# EAGLE design messverstaerker-adc-proto (EAGLE 9.6.0)
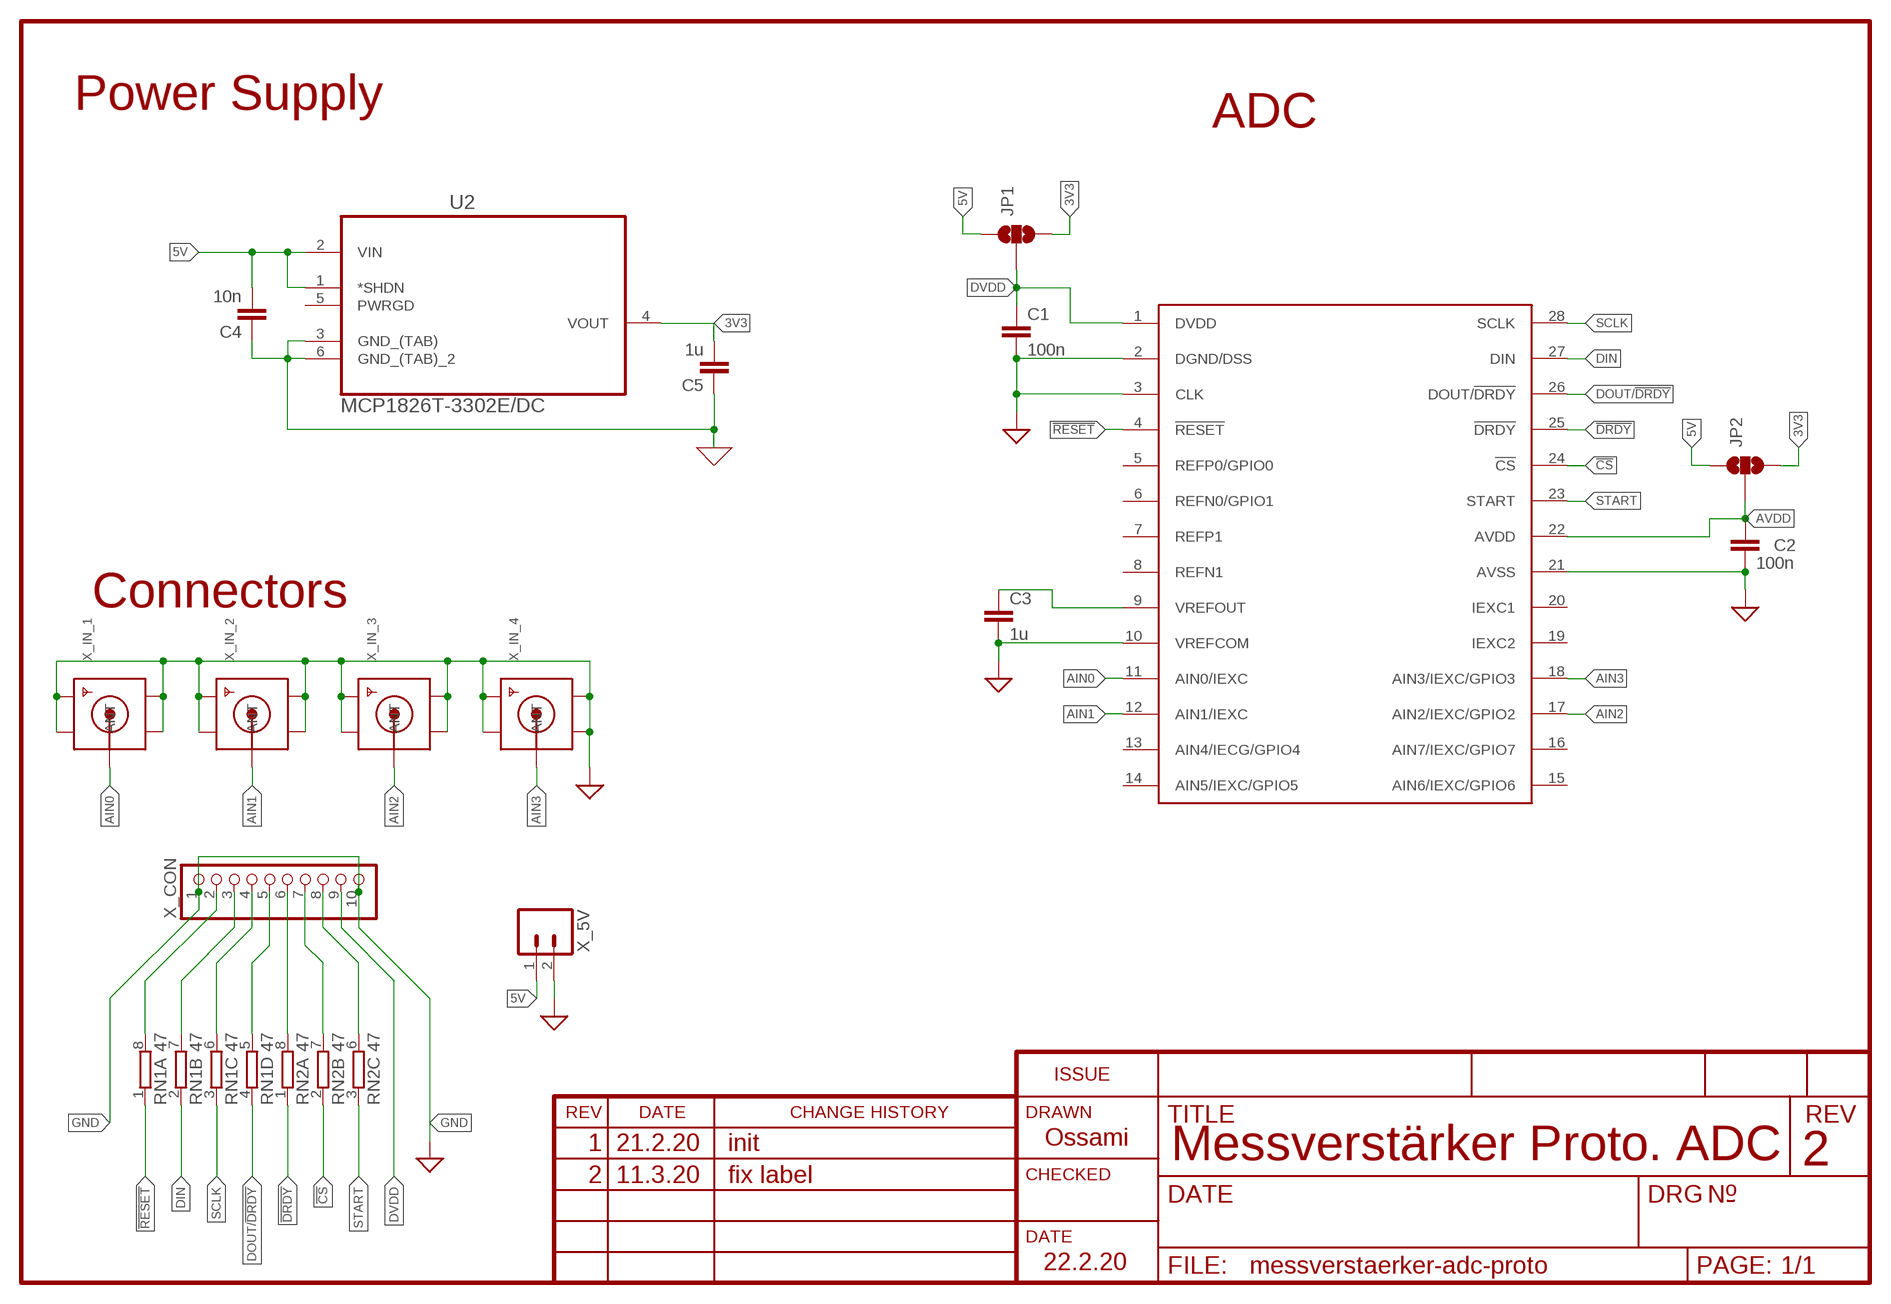
[diagram p0: schematic, sheet 1]

## Parts
C1  100n  C-EUC0805  [C0805]
C2  100n  C-EUC0805  [C0805]
C3  1u  C-EUC0805  [C0805]
C4  10n  C-EUC0805  [C0805]
C5  1u  C-EUC0805  [C0805]
JP1  JUMPER-SMT_3_NO_NO-SILK  [SMT-JUMPER_3_NO_NO-SILK]
JP2  JUMPER-SMT_3_NO_NO-SILK  [SMT-JUMPER_3_NO_NO-SILK]
RN1  47  4R-NEXBS8V  [EXBS8V]
RN2  47  4R-NEXBS8V  [EXBS8V]
U1  ADS1148QPWRQ1  [TSSOP28]
U2  MCP1826T-3302E/DC  MCP1826T-3002E/DC  [SOT230P700X180-6N]
X_5V  M02LOCK  [1X02_LOCK]
X_CON  PINHD-1X10  [1X10-BIG]
X_IN_1  SMACONNECTOR_EDGE  [SMA_EDGELAUNCH]
X_IN_2  SMACONNECTOR_EDGE  [SMA_EDGELAUNCH]
X_IN_3  SMACONNECTOR_EDGE  [SMA_EDGELAUNCH]
X_IN_4  SMACONNECTOR_EDGE  [SMA_EDGELAUNCH]

## Nets
0: C4.1 C5.1 U2.3(GND_(TAB)) U2.6(GND_(TAB)_2) ; supply symbol labelled GND
3V3: C5.2 JP1.3 JP2.3 U2.4(VOUT)
5V: C4.2 JP1.1 JP2.1 U2.1(*SHDN) U2.2(VIN) X_5V.1
!CS: RN2.2 U1.24(!CS)
!DRDY: RN2.1 U1.25(!DRDY)
!RESET: RN1.1 U1.4(!RESET)
AIN0: U1.11(AIN0/IEXC) X_IN_1.P(ANT)
AIN1: U1.12(AIN1/IEXC) X_IN_2.P(ANT)
AIN2: U1.17(AIN2/IEXC/GPIO2) X_IN_3.P(ANT)
AIN3: U1.18(AIN3/IEXC/GPIO3) X_IN_4.P(ANT)
AVDD: C2.1 JP2.2 U1.22(AVDD)
DIN: RN1.2 U1.27(DIN)
DOUT/!DRDY: RN1.4 U1.26(DOUT/!DRDY)
DVDD: C1.1 JP1.2 U1.1(DVDD) X_CON.9
GND: C1.2 C2.2 C3.2 U1.2(DGND/DSS) U1.3(CLK) U1.10(VREFCOM) U1.21(AVSS) X_5V.2 X_CON.1 X_CON.10 X_IN_1.GND@1(GND4) X_IN_1.GND@2(GND3) X_IN_1.GND@3(GND2) X_IN_1.GND@4(GND1) X_IN_2.GND@1(GND4) X_IN_2.GND@2(GND3) X_IN_2.GND@3(GND2) X_IN_2.GND@4(GND1) X_IN_3.GND@1(GND4) X_IN_3.GND@2(GND3) X_IN_3.GND@3(GND2) X_IN_3.GND@4(GND1) X_IN_4.GND@1(GND4) X_IN_4.GND@2(GND3) X_IN_4.GND@3(GND2) X_IN_4.GND@4(GND1) ; supply symbol labelled SUP
N$1: RN1.5 X_CON.5
N$2: C3.1 U1.9(VREFOUT)
N$3: RN2.8 X_CON.6
N$5: RN2.7 X_CON.7
N$6: RN2.6 X_CON.8
N$17: RN1.6 X_CON.4
N$18: RN1.7 X_CON.3
N$19: RN1.8 X_CON.2
SCLK: RN1.3 U1.28(SCLK)
START: RN2.3 U1.23(START)
Unconnected: RN2.4 RN2.5 U1.5(REFP0/GPIO0) U1.6(REFN0/GPIO1) U1.7(REFP1) U1.8(REFN1) U1.13(AIN4/IECG/GPIO4) U1.14(AIN5/IEXC/GPIO5) U1.15(AIN6/IEXC/GPIO6) U1.16(AIN7/IEXC/GPIO7) U1.19(IEXC2) U1.20(IEXC1) U2.5(PWRGD)

## Notes on the sheet
- Power Supply
- ADC
- Connectors
- 1  21.2.20    init | Ossami
- Messverstärker Proto. ADC | 2
- 2  11.3.20    fix label
- 22.2.20

## Library data of the parts
C1-C5 = rcl:C-EU: CAPACITOR, European symbol; SPICEPREFIX: C
JP1 JP2 = SparkFun-Jumpers:JUMPER-SMT_3_NO: Normally open jumper This jumper has three pads in close proximity to each other. Apply solder to close the connection(s).
RN1 RN2 = resistor-dil:4R-N: Array Chip Resistor Source: RS Component / Phycomp
U1 = ads11xx:ADS1148QPWRQ1
U2 = MCP1826T-3002E_DC:MCP1826T-3002E/DC: IC, LDO VOLT REG, 3V, 1A; AVAILABILITY: Good; DESCRIPTION: Ic, Linear Regulator; Max. Input, 6v; Output, 3v; 1000ma; Accuracy, 0.5%; Sot223-5; MF: Microchip; MP: MCP1826T-3002E/DC; PACKAGE: SOT-223 Microchip; PRICE: 0.59 USD
X_5V = aSparkFun:M02: Header 2 Standard 2-pin 0.1" header. Use with straight break away headers (SKU : PRT-00116), right angle break away headers (PRT-00553), swiss pins (PRT-00743), machine pins (PRT-00117), and female headers (PRT-00115). Molex polarized connector foot print use with SKU : PRT-08233 with associated crimp pins and housings.
X_CON = adafruit:PINHD-1X10: Pin header 1x10 0.1" spacing With round pins
X_IN_1-X_IN_4 = adafruit:SMACONNECTOR: SMA Connector 90° DIP SMA Connector, 50 Ohm (4UConnector: 07259)

## Board
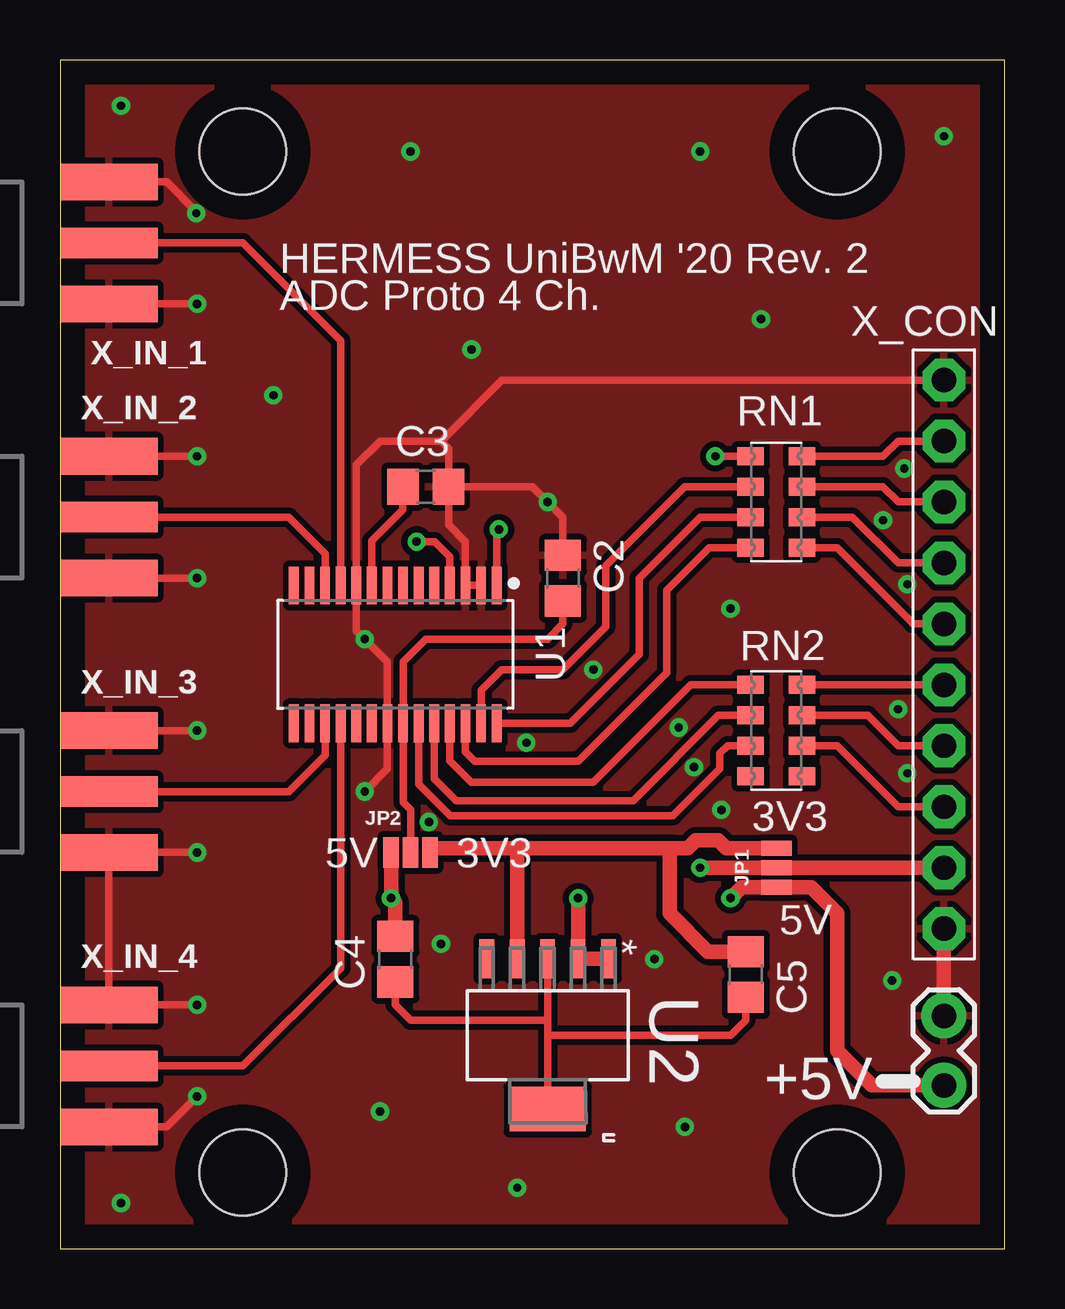
[diagram p1: board, top side]
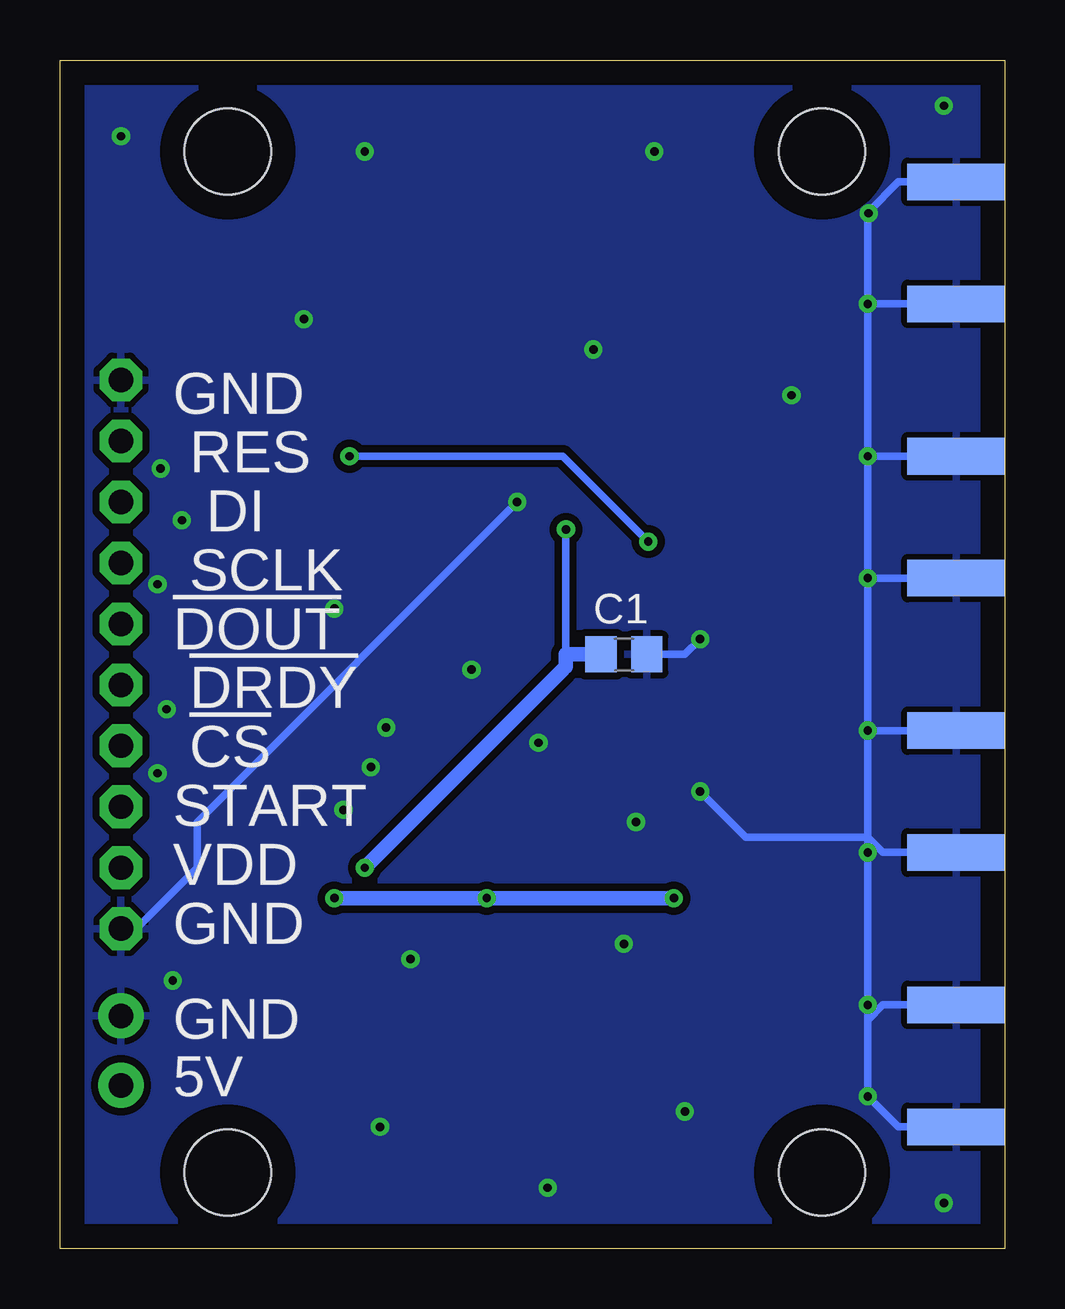
[diagram p2: board, bottom side, seen from below]

Size 39.37 x 49.53 mm. Coordinates in mm from the lower left corner, seen from the top.
Outline: 0,0 39.37,0 39.37,49.53 0,49.53 0,0
Copper layers (1*16): Top 0.035mm / dielectric 1.5mm / Bottom 0.035mm
Design rules "default": minimum track width 6mil, minimum drill 0.35mm, track to track 6mil, track to pad 6mil, pad to pad 6mil, via to via 6mil, smd to smd 6mil, copper to edge 40mil, drill to drill 6mil, minimum pad ring 10mil, minimum via ring 8mil, stop-mask expansion 4mil, vias tented up to drill 0mil, thermal gap 10mil
Holes 3.6 mm at 32.38,45.72 7.62,45.72 7.62,3.17 32.38,3.17

### Footprints (pad centres in the part's own frame; a part is rotated, then mirrored left to right if it is on the bottom)
C0805 = smd 1.3 x 1.5: 1 -0.95,0; 2 0.95,0
SMT-JUMPER_3_NO_NO-SILK = smd 0.635 x 1.27: 1 -0.813,0; 2 0,0; 3 0.813,0
EXBS8V = smd 0.75 x 1.1: 1 -1.905,-1.07; 2 -0.635,-1.07; 3 0.635,-1.07; 4 1.905,-1.07; 5 1.905,1.07; 6 0.635,1.07; 7 -0.635,1.07; 8 -1.905,1.07
TSSOP28 = smd 1.572 x 0.407: 1 -2.872,4.225; 2 -2.872,3.575; 3 -2.872,2.925; 4 -2.872,2.275; 5 -2.872,1.625; 6 -2.872,0.975; 7 -2.872,0.325; 8 -2.872,-0.325; 9 -2.872,-0.975; 10 -2.872,-1.625; 11 -2.872,-2.275; 12 -2.872,-2.925; 13 -2.872,-3.575; 14 -2.872,-4.225; 15 2.872,-4.225; 16 2.872,-3.575; 17 2.872,-2.925; 18 2.872,-2.275; 19 2.872,-1.625; 20 2.872,-0.975; 21 2.872,-0.325; 22 2.872,0.325; 23 2.872,0.975; 24 2.872,1.625; 25 2.872,2.275; 26 2.872,2.925; 27 2.872,3.575; 28 2.872,4.225
SOT230P700X180-6N = smd 1.626 x 0.61: 1 -3.2,2.54; 2 -3.2,1.27; 3 -3.2,0; 4 -3.2,-1.27; 5 -3.2,-2.54 | smd 1.854 x 3.175: 6 3.073,0
1X02_LOCK = drill 1.016 pad 1.88: 1 -0.178,0; 2 2.718,0
1X10-BIG = drill 1.016 pad 1.778 octagon: 1 -11.43,0; 2 -8.89,0; 3 -6.35,0; 4 -3.81,0; 5 -1.27,0; 6 1.27,0; 7 3.81,0; 8 6.35,0; 9 8.89,0; 10 11.43,0
SMA_EDGELAUNCH = smd 4.064 x 1.524: GND@1 2.032,-2.54; GND@2 2.032,2.54 | smd 4.064 x 1.524 bottom: GND@3 2.032,2.54; GND@4 2.032,-2.54 | smd 4.064 x 1.27: P 2.032,0

### Placement (x,y rotation side)
C1  15.88,24.77 0 bottom
C2  20.95,27.94 90 top
C3  15.24,31.75 0 top
C4  13.97,12.06 90 top
C5  28.57,11.43 90 top
JP1  29.84,15.88 90 top
JP2  14.61,16.51 0 top
RN1  29.84,31.11 270 top
RN2  29.84,21.59 270 top
U1  13.97,24.77 270 top
U2  20.32,8.89 270 top
X_5V  36.83,6.99 90 top
X_CON  36.83,24.77 270 top
X_IN_1  0,41.91 0 top
X_IN_2  0,30.48 0 top
X_IN_3  0,19.05 0 top
X_IN_4  0,7.62 0 top

### Tracks (layer width: path | path; a pad name or v marks a point on that pad's centre or on a via)
0
  Top 0.305: U2.6 20.32,8.89 | 20.32,8.89 20.32,9.53 | 20.32,9.53 U2.3 | C4.1 13.97,10.16 14.61,9.53 20.32,9.53 | C5.1 28.57,9.53 27.94,8.89 20.32,8.89
3V3
  Top 0.305: 26.04,16.69 25.4,16.69 24.13,16.69 | 19.05,16.69 19.05,16.51
  Top 0.61: JP1.3 27.76,16.69 27.43,17.02 26.49,17.02 26.16,16.69 26.04,16.69 25.58,16.69 | 25.4,16.51 25.4,13.97 26.99,12.38 C5.2 | 25.4,16.51 25.22,16.69 | 25.22,16.69 24.13,16.69 19.05,16.69 15.6,16.69 JP2.3 | 19.05,16.51 U2.4 | 25.4,16.51 25.58,16.69 | 25.4,16.51 25.4,16.69 | 25.22,16.69 25.58,16.69
5V  (via drill 0.35)
  Top 0.61: X_5V.1 33.83,6.81 32.38,8.26 32.38,13.97 31.29,15.06 JP1.1 28.4,15.06 v27.94,14.61 | v21.59,14.61 U2.2 U2.1 | C4.2 13.97,14.43 v13.79,14.61 JP2.1
  Bottom 0.61: v27.94,14.61 v21.59,14.61 v13.79,14.61
!CS
  Top 0.305: U1.24 15.6,19.58 16.51,18.67 23.88,18.67 27.43,22.23 RN2.2
!DRDY
  Top 0.305: U1.25 16.25,20.33 17.14,19.43 22.23,19.43 26.29,23.5 RN2.1
!RESET  (via drill 0.35)
  Top 0.305: U1.4 16.25,28.84 15.62,29.46 v14.86,29.46 | v27.3,33.02 RN1.1
  Bottom 0.305: v14.86,29.46 18.41,33.02 v27.3,33.02
AIN0
  Top 0.305: U1.11 11.7,37.84 7.62,41.91 X_IN_1.P
AIN1
  Top 0.305: X_IN_2.P 9.53,30.48 11.04,28.96 U1.12
AIN2
  Top 0.305: X_IN_3.P 9.53,19.05 11.04,20.57 U1.17
AIN3
  Top 0.305: X_IN_4.P 7.62,7.62 11.7,11.7 U1.18
AVDD
  Top 0.305: JP2.2 14.61,18.29 14.29,18.6 U1.22 14.29,24.45 15.24,25.4 20.32,25.4 20.95,26.04 C2.1
DIN
  Top 0.305: RN1.2 26.04,31.75 22.73,28.45 22.73,25.91 20.95,24.13 18.41,24.13 17.55,23.26 U1.27
DOUT/!DRDY
  Top 0.305: U1.26 16.89,20.7 17.27,20.32 21.59,20.32 25.27,24 25.27,27.43 27.05,29.21 RN1.4
DVDD  (via drill 0.35)
  Top 0.305: U1.1 18.2,29.88 v18.29,29.97
  Top 0.61: v26.67,15.88 JP1.2 X_CON.9
  Bottom 0.305: 18.29,24.26 18.41,24.13 | 18.29,24.77 v18.29,29.97
  Bottom 0.61: C1.1 18.29,24.77 18.29,24.26 | 18.41,24.13 v26.67,15.88
GND  (via drill 0.35)
  Top 0.305: U1.2 U1.3 16.89,29.46 16.19,30.16 C3.2 | C2.2 20.95,30.48 v20.32,31.11 19.68,31.75 C3.2 | C3.2 16.19,33.34 15.88,33.66 | 15.88,33.66 13.34,33.66 12.35,32.66 U1.10 12.35,25.75 v12.7,25.4 13.64,24.45 U1.21 13.64,20 v12.7,19.05 | X_CON.1 18.41,36.2 15.88,33.66 | X_IN_4.GND@1 4.45,5.08 v5.71,6.35 | X_IN_1.GND@3 4.45,44.45 5.68,43.22 v5.68,43.14 | X_IN_1.GND@4 v5.71,39.37 | X_IN_2.GND@2 v5.71,33.02 | X_IN_2.GND@1 v5.71,27.94 | X_IN_3.GND@3 v5.71,21.59 | v5.71,16.51 X_IN_3.GND@4 X_IN_4.GND@2 v5.71,10.16
  Top 0.61: X_5V.2 X_CON.10
  Bottom 0.305: C1.2 13.34,24.77 v12.7,25.4 | X_IN_4.GND@2 5.08,10.16 5.71,9.53 | 5.71,9.53 v5.71,6.35 4.45,5.08 X_IN_4.GND@1 | X_IN_3.GND@4 5.08,16.51 5.71,17.14 | 5.68,43.22 5.71,43.18 v5.71,39.37 | 5.68,43.22 4.45,44.45 X_IN_1.GND@3 | 5.71,17.14 v5.71,21.59 | v5.71,21.59 v5.71,27.94 | v5.71,27.94 v5.71,33.02 | v5.71,33.02 v5.71,39.37 | X_IN_1.GND@4 v5.71,39.37 | X_IN_2.GND@2 v5.71,33.02 | X_IN_2.GND@1 v5.71,27.94 | X_IN_3.GND@3 v5.71,21.59 | 5.71,17.14 v5.71,16.51 v5.71,10.16 5.71,9.53 | v5.68,43.14 5.68,43.22 | v12.7,19.05 10.79,17.14 5.71,17.14 | v20.32,31.11 33.66,17.78 33.66,15.88 36.2,13.34 X_CON.10
  other vias: 15.88,12.7 24.77,12.06 22.23,24.13 19.43,21.08 25.78,21.72 26.42,20.07 34.29,30.35 35.18,32.51 35.31,27.69 34.92,22.48 35.31,19.81 15.37,17.78 13.34,5.71 19.05,2.54 26.04,5.08 27.56,18.29 34.67,11.18 27.94,26.67 8.89,35.56 17.14,37.47 29.21,38.73 36.83,46.35 26.67,45.72 14.61,45.72 2.54,47.62 2.54,1.91
  pour Bottom (isolate 0.305): -0.64,50.16 40.01,50.16 40.01,-0.64 -0.64,-0.64
  pour Top (isolate 0.254): 40.01,50.16 -0.64,50.16 -0.64,-0.64 40.01,-0.64
N$1
  Top 0.305: X_CON.5 35.56,26.04 32.38,29.21 RN1.5
N$2
  Top 0.305: U1.9 12.99,29.5 14.29,30.8 C3.1
N$3
  Top 0.305: RN2.8 X_CON.6
N$5
  Top 0.305: X_CON.7 34.92,20.95 33.66,22.23 RN2.7
N$6
  Top 0.305: RN2.6 32.38,20.95 34.92,18.41 X_CON.8
N$17
  Top 0.305: RN1.6 33.02,30.48 34.92,28.57 X_CON.4
N$18
  Top 0.305: X_CON.3 34.92,31.11 34.29,31.75 RN1.7
N$19
  Top 0.305: X_CON.2 34.92,33.66 34.29,33.02 RN1.8
SCLK
  Top 0.305: U1.28 21.26,21.89 24.13,24.77 24.13,27.94 26.67,30.48 RN1.3
START
  Top 0.305: U1.23 14.95,19.34 16.26,18.03 25.53,18.03 27.5,20 27.5,20.64 27.81,20.95 RN2.3 28.57,20.95

### Text on the board
tNames: HERMESS UniBwM '20 Rev. 2 / ADC Proto 4 Ch. | 3V3 | 5V | 3V3 | 5V | +5V
bNames: GND / RES / DI / SCLK / !DOUT / !DRDY / !CS / START / VDD / GND | GND / 5V